# EAGLE schematic uzenet-module-v2_0 (EAGLE 9.6.2)
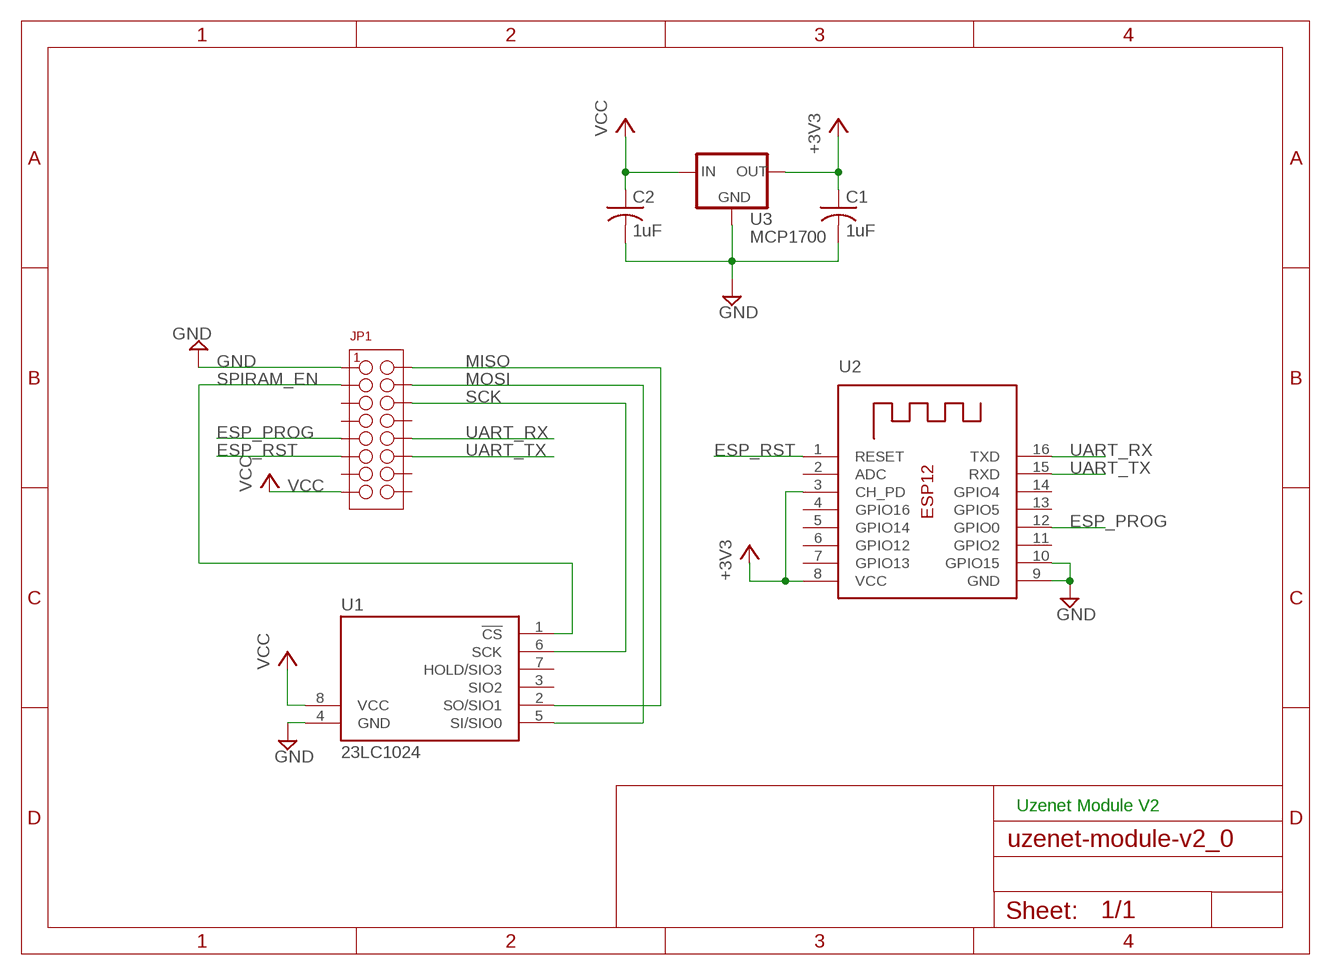
[diagram p0: schematic, sheet 1]

## Parts
C1  1uF  C-US025-025X050  [C025-025X050]
C2  1uF  C-US025-025X050  [C025-025X050]
JP1  NPPC082KFMS-RC  [HEADER_2X8_SMT_BOTTOM_LAYER]
U1  23LC1024  [DIL08]
U2  ESP-12  [ESP-12]
U3  MCP1700  MCP1700INLINE  [TO92-INLINE]

## Nets
+3V3 [Power]: C1.1 U2.3(CH_PD) U2.8(VCC) U3.3(OUT)
ESP_PROG: JP1.P$9 U2.12(GPIO0)
ESP_RST: JP1.P$11 U2.1(RESET)
GND [Ground]: C1.2 C2.2 JP1.P$1 U1.4(GND) U2.9(GND) U2.10(GPIO15) U3.1(GND)
MISO: JP1.P$2 U1.2(SO/SIO1)
MOSI: JP1.P$4 U1.5(SI/SIO0)
SCK: JP1.P$6 U1.6(SCK)
SPIRAM_EN: JP1.P$3 U1.1(!CS)
UART_RX: JP1.P$10 U2.16(TXD)
UART_TX: JP1.P$12 U2.15(RXD)
VCC [Power]: C2.1 JP1.P$15 U1.8(VCC) U3.2(IN)
Unconnected: JP1.P$5 JP1.P$7 JP1.P$8 JP1.P$13 JP1.P$14 JP1.P$16 U1.3(SIO2) U1.7(HOLD/SIO3) U2.2(ADC) U2.4(GPIO16) U2.5(GPIO14) U2.6(GPIO12) U2.7(GPIO13) U2.11(GPIO2) U2.13(GPIO5) U2.14(GPIO4)

## Notes on the sheet
- Uzenet Module V2

## Library data of the parts
C1 C2 = adafruit:C-US: CAPACITOR, American symbol
JP1 = uzebox:NPPC082KFMS-RC
U1 = uzebox:23LC1024: 1Mbit SPI Serial SRAM with SDI and SQI Interface
U2 = uzebox:ESP-12
U3 = adafruit:MCP1700: VOLTAGE REGULATOR

## Net classes
0 default: width 0.254 mm
1 Ground: width 0.406 mm
2 Power: width 0.406 mm